# Altium schematic sheet 05_ESP32.SchDoc
size A4; CheckedBy: Doo; Author: Doo; DocumentNumber: PIF_C24_VRS02; Revision: RV_01; SheetNumber: 6; SheetTotal: 7
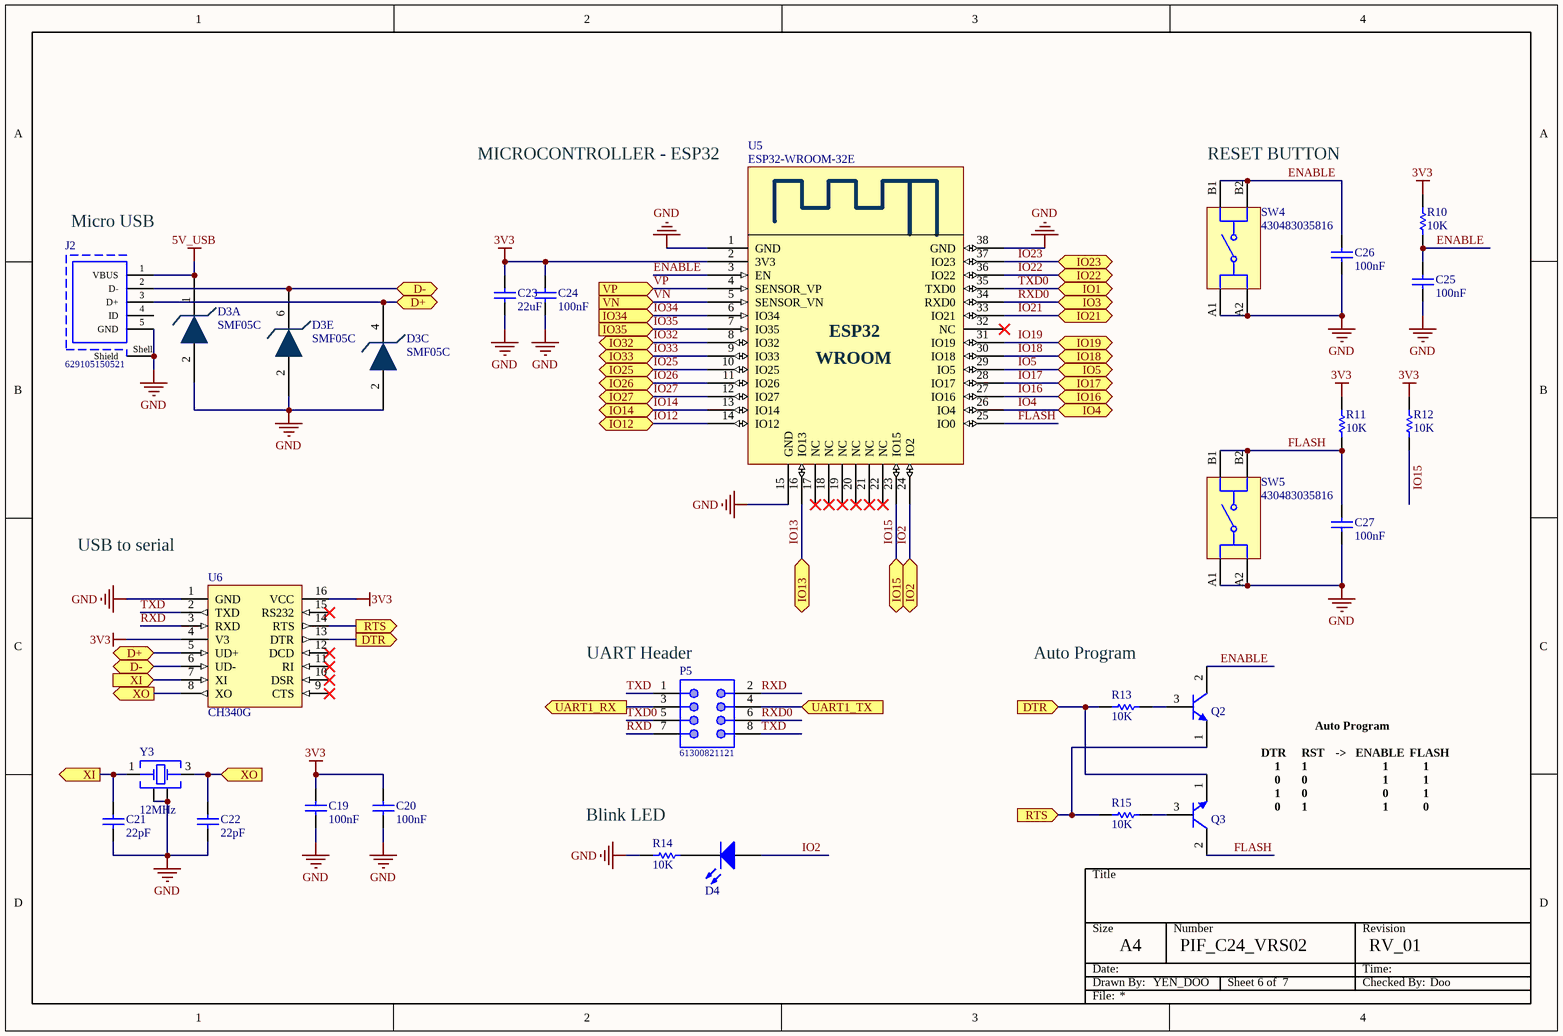
[diagram p0: 05_ESP32.SchDoc]

## Parts
C19  value 100nF  [CAP-SM-0805]  (hidden comment: Cap Non-Pol SMD)
C20  value 100nF  [CAP-SM-0805]  (hidden comment: Cap Non-Pol SMD)
C21  value 22pF  [CAP-SM-0805]  (hidden comment: Cap Non-Pol SMD)
C22  value 22pF  [CAP-SM-0805]  (hidden comment: Cap Non-Pol SMD)
C23  value 22uF  [CAP-SM-0805]  (hidden comment: Cap Non-Pol SMD)
C24  value 100nF  [CAP-SM-0805]  (hidden comment: Cap Non-Pol SMD)
C25  value 100nF  [CAP-SM-0805]  (hidden comment: Cap Non-Pol SMD)
C26  value 100nF  [CAP-SM-0805]  (hidden comment: Cap Non-Pol SMD)
C27  value 100nF  [CAP-SM-0805]  (hidden comment: Cap Non-Pol SMD)
D3  SMF05C  [SC70 6L]  (parts A,C,E of 5)
D4  LED SMD  [LED_0805_Blue]  (value not drawn)
J2  629105150521  [629105150521]
P5  61300821121  [61300821121]
Q2  C1815  [SOT23B]  (value not drawn)
Q3  C1815  [SOT23B]  (value not drawn)
R10  value 10K  [RES-SM-0805]  (hidden comment: RESISTOR SMD)
R11  value 10K  [RES-SM-0805]  (hidden comment: RESISTOR SMD)
R12  value 10K  [RES-SM-0805]  (hidden comment: RESISTOR SMD)
R13  value 10K  [RES-SM-0805]  (hidden comment: RESISTOR SMD)
R14  value 10K  [RES-SM-0805]  (hidden comment: RESISTOR SMD)
R15  value 10K  [RES-SM-0805]  (hidden comment: RESISTOR SMD)
SW4  430483035816  [WS-TASV_L6W6H3.5_4304x30358x6]
SW5  430483035816  [WS-TASV_L6W6H3.5_4304x30358x6]
U5  ESP32-WROOM-32E  [ESP32-WROOM]
U6  CH340G  [DSIP-16]
Y3  12MHz  [WE-XTAL_CFPX-104]

## Ports
D+ (bidir), D- (bidir), DTR (in), DTR (out), IO1 (bidir), IO2 (bidir), IO3 (bidir), IO4 (bidir), IO5 (bidir), IO12 (bidir), IO13 (bidir), IO14 (bidir), IO15 (bidir), IO16 (bidir), IO17 (bidir), IO18 (bidir), IO19 (bidir), IO21 (bidir), IO22 (bidir), IO23 (bidir), IO25 (bidir), IO26 (bidir), IO27 (bidir), IO32 (bidir), IO33 (bidir), IO34 (in), IO35 (in), RTS (in), RTS (out), UART1_RX (out), UART1_TX (in), VN (in), VP (in), XI (in), XI (out), XO (in), XO (out)

## Nets
3V3: C19.2 C20.2 C23.2 C24.2 R10.2 R11.2 R12.2 U5.2(3V3) U6.4(V3) U6.16(VCC)
5V_USB: D3.1 J2.1(VBUS)
GND: C19.1 C20.1 C21.1 C22.1 C23.1 C24.1 C25.1 C26.1 C27.1 D3.2(COM) J2.5(GND) J2.Shell(Shield) R14.1 SW4.A1 SW4.A2 SW5.A1 SW5.A2 U5.1(GND) U5.15(GND) U5.38(GND) U6.1(GND) Y3.2(GND_&_Lid) Y3.4(GND_&_Lid)
D+: D3.4 J2.3(D+) U6.5(UD+) ; port D+
D-: D3.6 J2.2(D-) U6.6(UD-) ; port D-
DTR: Q3.1(E) R13.2 U6.13(DTR) ; port DTR
ENABLE: C25.2 C26.2 Q2.2(C) R10.1 SW4.B1 SW4.B2 U5.3(EN)
FLASH: C27.2 Q3.2(C) R11.1 SW5.B1 SW5.B2 U5.25(IO0)
IO2: D4.1(A) U5.24(IO2) ; port IO2
IO4: U5.26(IO4) ; port IO4
IO5: U5.29(IO5) ; port IO5
IO12: U5.14(IO12) ; port IO12
IO13: U5.16(IO13) ; port IO13
IO14: U5.13(IO14) ; port IO14
IO15: R12.1 U5.23(IO15) ; port IO15
IO16: U5.27(IO16) ; port IO16
IO17: U5.28(IO17) ; port IO17
IO18: U5.30(IO18) ; port IO18
IO19: U5.31(IO19) ; port IO19
IO21: U5.33(IO21) ; port IO21
IO22: U5.36(IO22) ; port IO22
IO23: U5.37(IO23) ; port IO23
IO25: U5.10(IO25) ; port IO25
IO26: U5.11(IO26) ; port IO26
IO27: U5.12(IO27) ; port IO27
IO32: U5.8(IO32) ; port IO32
IO33: U5.9(IO33) ; port IO33
IO34: U5.6(IO34) ; port IO34
IO35: U5.7(IO35) ; port IO35
RTS: Q2.1(E) R15.2 U6.14(RTS) ; port RTS
RXD: P5.2 P5.7 U6.3(RXD)
RXD0: P5.6 U5.34(RXD0) ; port IO3
TXD: P5.1 P5.8 U6.2(TXD)
TXD0: P5.5 U5.35(TXD0) ; port IO1
UART1_RX: P5.3 ; port UART1_RX
UART1_TX: P5.4 ; port UART1_TX
VN: U5.5(SENSOR_VN) ; port VN
VP: U5.4(SENSOR_VP) ; port VP
XI: C21.2 U6.7(XI) Y3.1(Crystal) ; port XI
XO: C22.2 U6.8(XO) Y3.3(Crystal) ; port XO
NetD4_2: D4.2(K) R14.2
NetQ2_3: Q2.3(B) R13.1
NetQ3_3: Q3.3(B) R15.1

Not connected (* = marked no-connect by the designer): J2 4(ID); U5 17(NC)* 18(NC)* 19(NC)* 20(NC)* 21(NC)* 22(NC)* 32(NC)*; U6 9(CTS)* 10(DSR)* 11(RI)* 12(DCD)* 15(RS232)*

## Notes on the sheet
- MICROCONTROLLER - ESP32
- (near SW4) RESET BUTTON
- (near J2) Micro USB
- (near U6) USB to serial
- (near P5) UART Header
- Auto Program
- DTR
- 1
- 0
- RST
- ->
- ENABLE
- FLASH
- (near R14) Blink LED
- Title
- Size
- Date:
- Drawn By:
- A4
- YEN_DOO
- Number
- Revision
- Checked By:
- Time:
- File:
- (in symbol ESP32-WROOM) WROOM

## Library data of the parts
C19-C27 = Cap Non-Pol SMD: Capacitor
D3 = SMF05: 12.5V Clamp 8A (8/20µs) Ipp Tvs Diode Surface Mount SC-70-6; Mfr: Semtech Corporation; Type: Zener; Unidirectional Channels: 5; Voltage - Reverse Standoff (Typ): 5V (Max); Voltage - Breakdown (Min): 6V; Power - Peak Pulse: 100W; Capacitance @ Frequency: 130pF @ 1MHz; Category: Circuit Protection; Voltage - Clamping (Max) @ Ipp: 12.5V; Current - Peak Pulse (10/1000µs): 8A (8/20µs); Operating Temperature: -55°C ~ 125°C (TJ); ComponentLink1Description: Datasheet; ComponentLink1URL: https://datasheet.lcsc.com/lcsc/1809291621_SEMTECH-SMF05C-TCT_C85191.pdf*; ComponentLink2Description: Thegioiic; ComponentLink2URL: https://www.thegioiic.com/smf05c-tct
D4 = LED SMD: LED
J2 = 629105150521: Micro USB 2.0 Type B Receptacle WR-COM, Horizontal, SMT, with Pegs, High Current at Pin 1 & Pin 5; Rated Current: 3 A; Contact Resistance: 30 mOhm; Working Voltage: 30 VAC; ComponentLink1Description: Manufacturer; ComponentLink1URL: http://www.we-online.de; ComponentLink2Description: Datasheet; ComponentLink2URL: https://katalog.we-online.de/em/datasheet/629105150521.pdf; Part Number: 629105150521; Published Date: September 2018; Publisher: Wurth Elektronik; Orientation: Horizontal; Connector Type: Micro USB 2.0 Type B; Operating Temperature: -40 to 85 degC; Mounting Technology: SMT; Gender: Receptacle; Packaging: Tape and Reel
P5 = 61300821121: WR-PHD Pin Header, THT, pitch 2.54mm, Dual Row, Vertical, 8p; Manufacturer: Wurth Elektronik; Pin Number: 8; Rated Current: 3A; Working Voltage: 250VAC; Withstanding Voltage: 500VAC; Contact Resistance: 20mOhm; ComponentLink1Description: Manufacturer; ComponentLink1URL: http://www.we-online.de; ComponentLink2Description: Datasheet; ComponentLink2URL: https://www.we-online.com/catalog/datasheet/61300821121.pdf; Manufacturer Part Number: 61300821121; Published Date: May 2020; Pitch: 2.54mm; Operating Temperature: -40 to +105degC; Mounting Technology: THT; Packaging: Bag; Gender: Pin Header; Row Number: Dual; Orientation: Vertical
Q2 Q3 = C1815: NPN Bipolar Transistor
R10-R15 = RESISTOR SMD: Resistor
SW4 SW5 = 430483035816: WS-TASV J-Bend SMT Washable Tact Switch, 12VDC, 50mA, 160g, height 3.5mm; Manufacturer: Wurth Elektronik; Rated Voltage: 12V; Washable: Yes; Actuator Color: Black; Electrical Life: 1000000Cycles; ComponentLink1Description: Manufacturer Link; ComponentLink1URL: http://www.we-online.de; ComponentLink2Description: Datasheet; ComponentLink2URL: https://www.we-online.com/catalog/datasheet/430483035816.pdf; Manufacturer Part Number: 430483035816; Contact Material: Stainless Steel; Mounting Technology: SMT; Contact Plating: Silver; Operation Force: 160g; Packaging: Tape and Reel; Terminal Material: Copper Alloy; Rated Current: 50mA; Terminal Plating: Silver; Height: 3.5mm; Length: 6mm; Operating Temperature max.: 85C; Operating Temperature min.: -40C; Width: 6mm
U5 = ESP32-WROOM: Bluetooth, WiFi 802.11b/g/n, Bluetooth v4.2 +EDR, Class 1, 2 and 3 Transceiver Module 2.4GHz ~ 2.5GHz Integrated, Trace Surface Mount; Mfr: Espressif Systems; Utilized IC / Part: ESP32-D0WD-V3; Modulation: CCK, DSSS, OFDM; Data Rate: 150Mbps; Power - Output: 20dBm; Sensitivity: -98dBm; Serial Interfaces: ADC, GPIO, I²C, I²S, PWM, SDIO, SPI, UART; Memory Size: 4MB Flash, 448kB ROM, 536kB SRAM; Voltage - Supply: 3V ~ 3.6V; Category: RF and Wireless; Series: ESP32; RF Family/Standard: Bluetooth, WiFi; Protocol: 802.11b/g/n, Bluetooth v4.2 +EDR, Class 1, 2 and 3; Frequency: 2.4GHz ~ 2.5GHz; Antenna Type: Integrated, Trace; Mounting Type: Surface Mount; ComponentLink1Description: Hshop; ComponentLink1URL: https://hshop.vn/products/mach-thu-phat-wifi-ble-soc-esp32-v1; Operating Temperature: -40°C ~ 85°C; ComponentLink2Description: Datasheet; ComponentLink2URL: https://www.espressif.com/sites/default/files/russianDocumentation/esp32-wroom-32e_esp32-wroom-32ue_datasheet_en.pdf
U6 = CH340: USB Bridge, USB to UART USB 2.0 UART Interface; Mfr: SparkFun Electronics; Standards: USB 2.0; Voltage - Supply: 3V ~ 3.6V; Current - Supply: 20mA; Protocol: USB; Function: Bridge, USB to UART; Interface: UART; Operating Temperature: -20°C ~ 70°C (TA); ComponentLink1Description: Thegioiic; ComponentLink1URL: https://www.thegioiic.com/ch340g; ComponentLink2Description: Datasheet; ComponentLink2URL: https://www.thegioiic.com/upload/documents/5d39d5f0043101a4c964078db79fe1bd.PDF
Y3 = 830055999: WE-XTAL Quartz Crystal, SMT, CFPX-104, 12MHz, +/-30ppm; Manufacturer: Wurth Elektronik; Load Capacitance: 18pF; ComponentLink1Description: Manufacturer; ComponentLink1URL: http://www.we-online.de; ComponentLink2Description: Datasheet; ComponentLink2URL: https://katalog.we-online.com/pbs/datasheet/830055999.pdf; Operating Temperature: -40 to +85degC; Packaging: Tape and Reel; Manufacturer Part Number: 830055999; Published Date: July 2020; Size: CFPX-104; Frequency Stability: +/-30ppm; Frequency: 12MHz; Frequency Tolerance: +/-30ppm; Mounting Technology: SMT